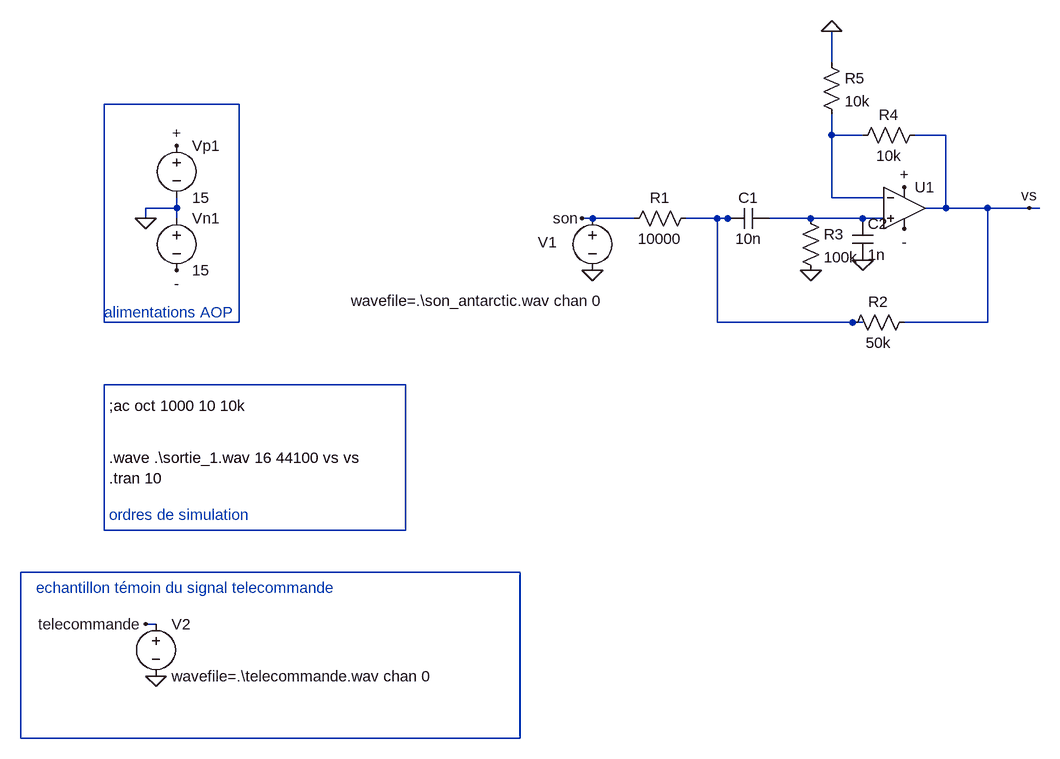
[diagram p0: schematic mini_projet_S4A.asc]
mini_projet_S4A.asc, the LTspice schematic file:
Version 4
SHEET 1 2136 680
WIRE -2176 -1984 -2176 -2032
WIRE -3088 -1920 -3296 -1920
WIRE -2176 -1872 -2176 -1904
WIRE -2128 -1872 -2176 -1872
WIRE -2000 -1872 -2048 -1872
WIRE -2176 -1776 -2176 -1872
WIRE -2096 -1776 -2176 -1776
WIRE -3184 -1760 -3184 -1776
WIRE -3184 -1760 -3232 -1760
WIRE -2000 -1760 -2000 -1872
WIRE -2000 -1760 -2032 -1760
WIRE -1936 -1760 -2000 -1760
WIRE -1872 -1760 -1936 -1760
WIRE -1856 -1760 -1872 -1760
WIRE -3232 -1744 -3232 -1760
WIRE -3184 -1744 -3184 -1760
WIRE -2544 -1744 -2560 -1744
WIRE -2480 -1744 -2544 -1744
WIRE -2352 -1744 -2400 -1744
WIRE -2336 -1744 -2352 -1744
WIRE -2320 -1744 -2336 -1744
WIRE -2208 -1744 -2272 -1744
WIRE -2128 -1744 -2208 -1744
WIRE -2096 -1744 -2128 -1744
WIRE -3296 -1584 -3296 -1920
WIRE -3088 -1584 -3088 -1920
WIRE -3088 -1584 -3296 -1584
WIRE -2352 -1584 -2352 -1744
WIRE -2144 -1584 -2352 -1584
WIRE -2128 -1584 -2144 -1584
WIRE -1936 -1584 -1936 -1760
WIRE -1936 -1584 -2064 -1584
WIRE -2832 -1488 -3296 -1488
WIRE -3296 -1264 -3296 -1488
WIRE -2832 -1264 -2832 -1488
WIRE -2832 -1264 -3296 -1264
WIRE -2656 -1200 -3424 -1200
WIRE -3216 -1120 -3232 -1120
WIRE -3424 -944 -3424 -1200
WIRE -2656 -944 -2656 -1200
WIRE -2656 -944 -3424 -944
FLAG -2544 -1664 0
FLAG -3232 -1744 0
FLAG -3184 -1856 +
FLAG -3184 -1664 -
FLAG -2560 -1744 son
FLAG -3216 -1040 0
FLAG -3232 -1120 telecommande
FLAG -2064 -1792 +
FLAG -2064 -1728 -
FLAG -1872 -1760 vs
FLAG -2128 -1680 0
FLAG -2208 -1664 0
FLAG -2176 -2032 0
SYMBOL voltage -2544 -1760 R0
WINDOW 123 0 0 Left 2
WINDOW 39 0 0 Left 2
WINDOW 0 -84 53 Left 2
WINDOW 3 -372 143 Left 2
SYMATTR InstName V1
SYMATTR Value wavefile=.\son_antarctic.wav chan 0
SYMBOL voltage -3184 -1872 R0
WINDOW 123 0 0 Left 2
WINDOW 39 0 0 Left 2
SYMATTR InstName Vp1
SYMATTR Value 15
SYMBOL voltage -3184 -1760 R0
WINDOW 123 0 0 Left 2
WINDOW 39 0 0 Left 2
SYMATTR InstName Vn1
SYMATTR Value 15
SYMBOL voltage -3216 -1136 R0
WINDOW 123 0 0 Left 2
WINDOW 39 0 0 Left 2
SYMATTR InstName V2
SYMATTR Value wavefile=.\telecommande.wav chan 0
SYMBOL Opamps\\UniversalOpamp2 -2064 -1760 R0
SYMATTR InstName U1
SYMBOL res -2496 -1728 R270
WINDOW 0 32 56 VTop 2
WINDOW 3 0 56 VBottom 2
SYMATTR InstName R1
SYMATTR Value 10000
SYMBOL res -2160 -1568 R270
WINDOW 0 32 56 VTop 2
WINDOW 3 0 56 VBottom 2
SYMATTR InstName R2
SYMATTR Value 50k
SYMBOL cap -2144 -1744 R0
SYMATTR InstName C2
SYMATTR Value 1n
SYMBOL cap -2336 -1728 R270
WINDOW 0 32 32 VTop 2
WINDOW 3 0 32 VBottom 2
SYMATTR InstName C1
SYMATTR Value 10n
SYMBOL res -2224 -1760 R0
SYMATTR InstName R3
SYMATTR Value 100k
SYMBOL res -2144 -1856 R270
WINDOW 0 32 56 VTop 2
WINDOW 3 0 56 VBottom 2
SYMATTR InstName R4
SYMATTR Value 10k
SYMBOL res -2192 -2000 R0
SYMATTR InstName R5
SYMATTR Value 10k
TEXT -3288 -1456 Left 2 !;ac oct 1000 10 10k
TEXT -3296 -1600 Left 2 ;alimentations AOP
TEXT -3288 -1288 Left 2 ;ordres de simulation
TEXT -3288 -1376 Left 2 !.wave .\\sortie_1.wav 16 44100 vs vs
TEXT -3288 -1344 Left 2 !.tran 10
TEXT -3400 -1176 Left 2 ;echantillon témoin du signal telecommande

The netlist it stands for:
* mini_projet_S4A.asc
V1 son 0 wavefile=.\son_antarctic.wav chan 0
Vp1 + 0 15
Vn1 0 - 15
V2 telecommande 0 wavefile=.\telecommande.wav chan 0
XU1 N004 N002 + - vs level.2 Avol=1Meg GBW=10Meg Slew=10Meg ilimit=25m rail=0 Vos=0 phimargin=45 en=0 enk=0 in=0 ink=0 Rin=500Meg  ; pins IN+ IN- V+ V- OUT
R1 son N003 10000
R2 N003 vs 50k
C2 N004 0 1n
C1 N003 N004 10n
R3 N004 0 100k
R4 N002 vs 10k
R5 0 N002 10k
;ac oct 1000 10 10k
* alimentations AOP
* ordres de simulation
.wave .\sortie_1.wav 16 44100 vs vs
.tran 10
* echantillon témoin du signal telecommande
.lib UniversalOpamps2.sub
.backanno
.end